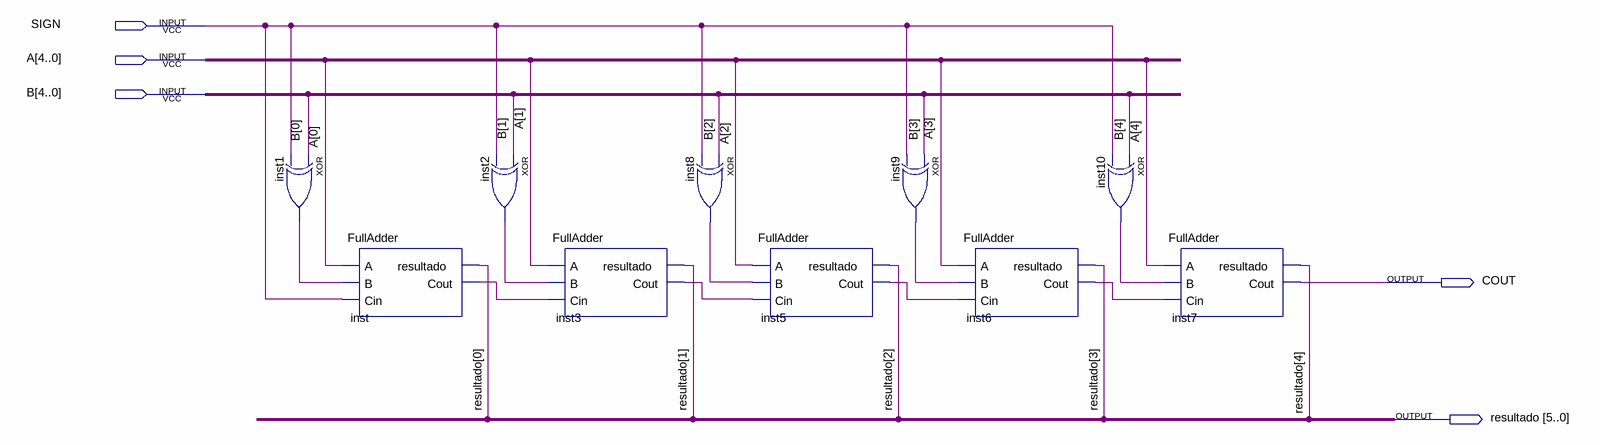
[diagram p0: schematic sheet]
// Quartus schematic Adder-Subtractor5bit.bdf as structural Verilog: 10 symbols, 5 pins
module \Adder-Subtractor5bit  (
  input  SIGN,
  input  [4:0] A,
  input  [4:0] B,
  output COUT,
  output [5:0] resultado
);

  wire inst1_out, inst2_out, inst3_cout, inst5_cout, inst6_cout, inst8_out, inst9_out, inst10_out, inst_cout;

  xor inst1 (inst1_out, B[0], SIGN);
  FullAdder inst (.A(A[0]), .B(inst1_out), .Cin(SIGN), .resultado(resultado[0]), .Cout(inst_cout));
  xor inst2 (inst2_out, B[1], SIGN);
  FullAdder inst3 (.A(A[1]), .B(inst2_out), .Cin(inst_cout), .resultado(resultado[1]), .Cout(inst3_cout));
  xor inst8 (inst8_out, B[2], SIGN);
  FullAdder inst5 (.A(A[2]), .B(inst8_out), .Cin(inst3_cout), .resultado(resultado[2]), .Cout(inst5_cout));
  xor inst9 (inst9_out, B[3], SIGN);
  FullAdder inst6 (.A(A[3]), .B(inst9_out), .Cin(inst5_cout), .resultado(resultado[3]), .Cout(inst6_cout));
  xor inst10 (inst10_out, B[4], SIGN);
  FullAdder inst7 (.A(A[4]), .B(inst10_out), .Cin(inst6_cout), .resultado(resultado[4]), .Cout(COUT));
endmodule
